# Altium schematic sheet RAK3162_SX1262.SchDoc
size A3; SheetNumber: 2; SheetTotal: 3; PCBA_CODE: 8262XXXX
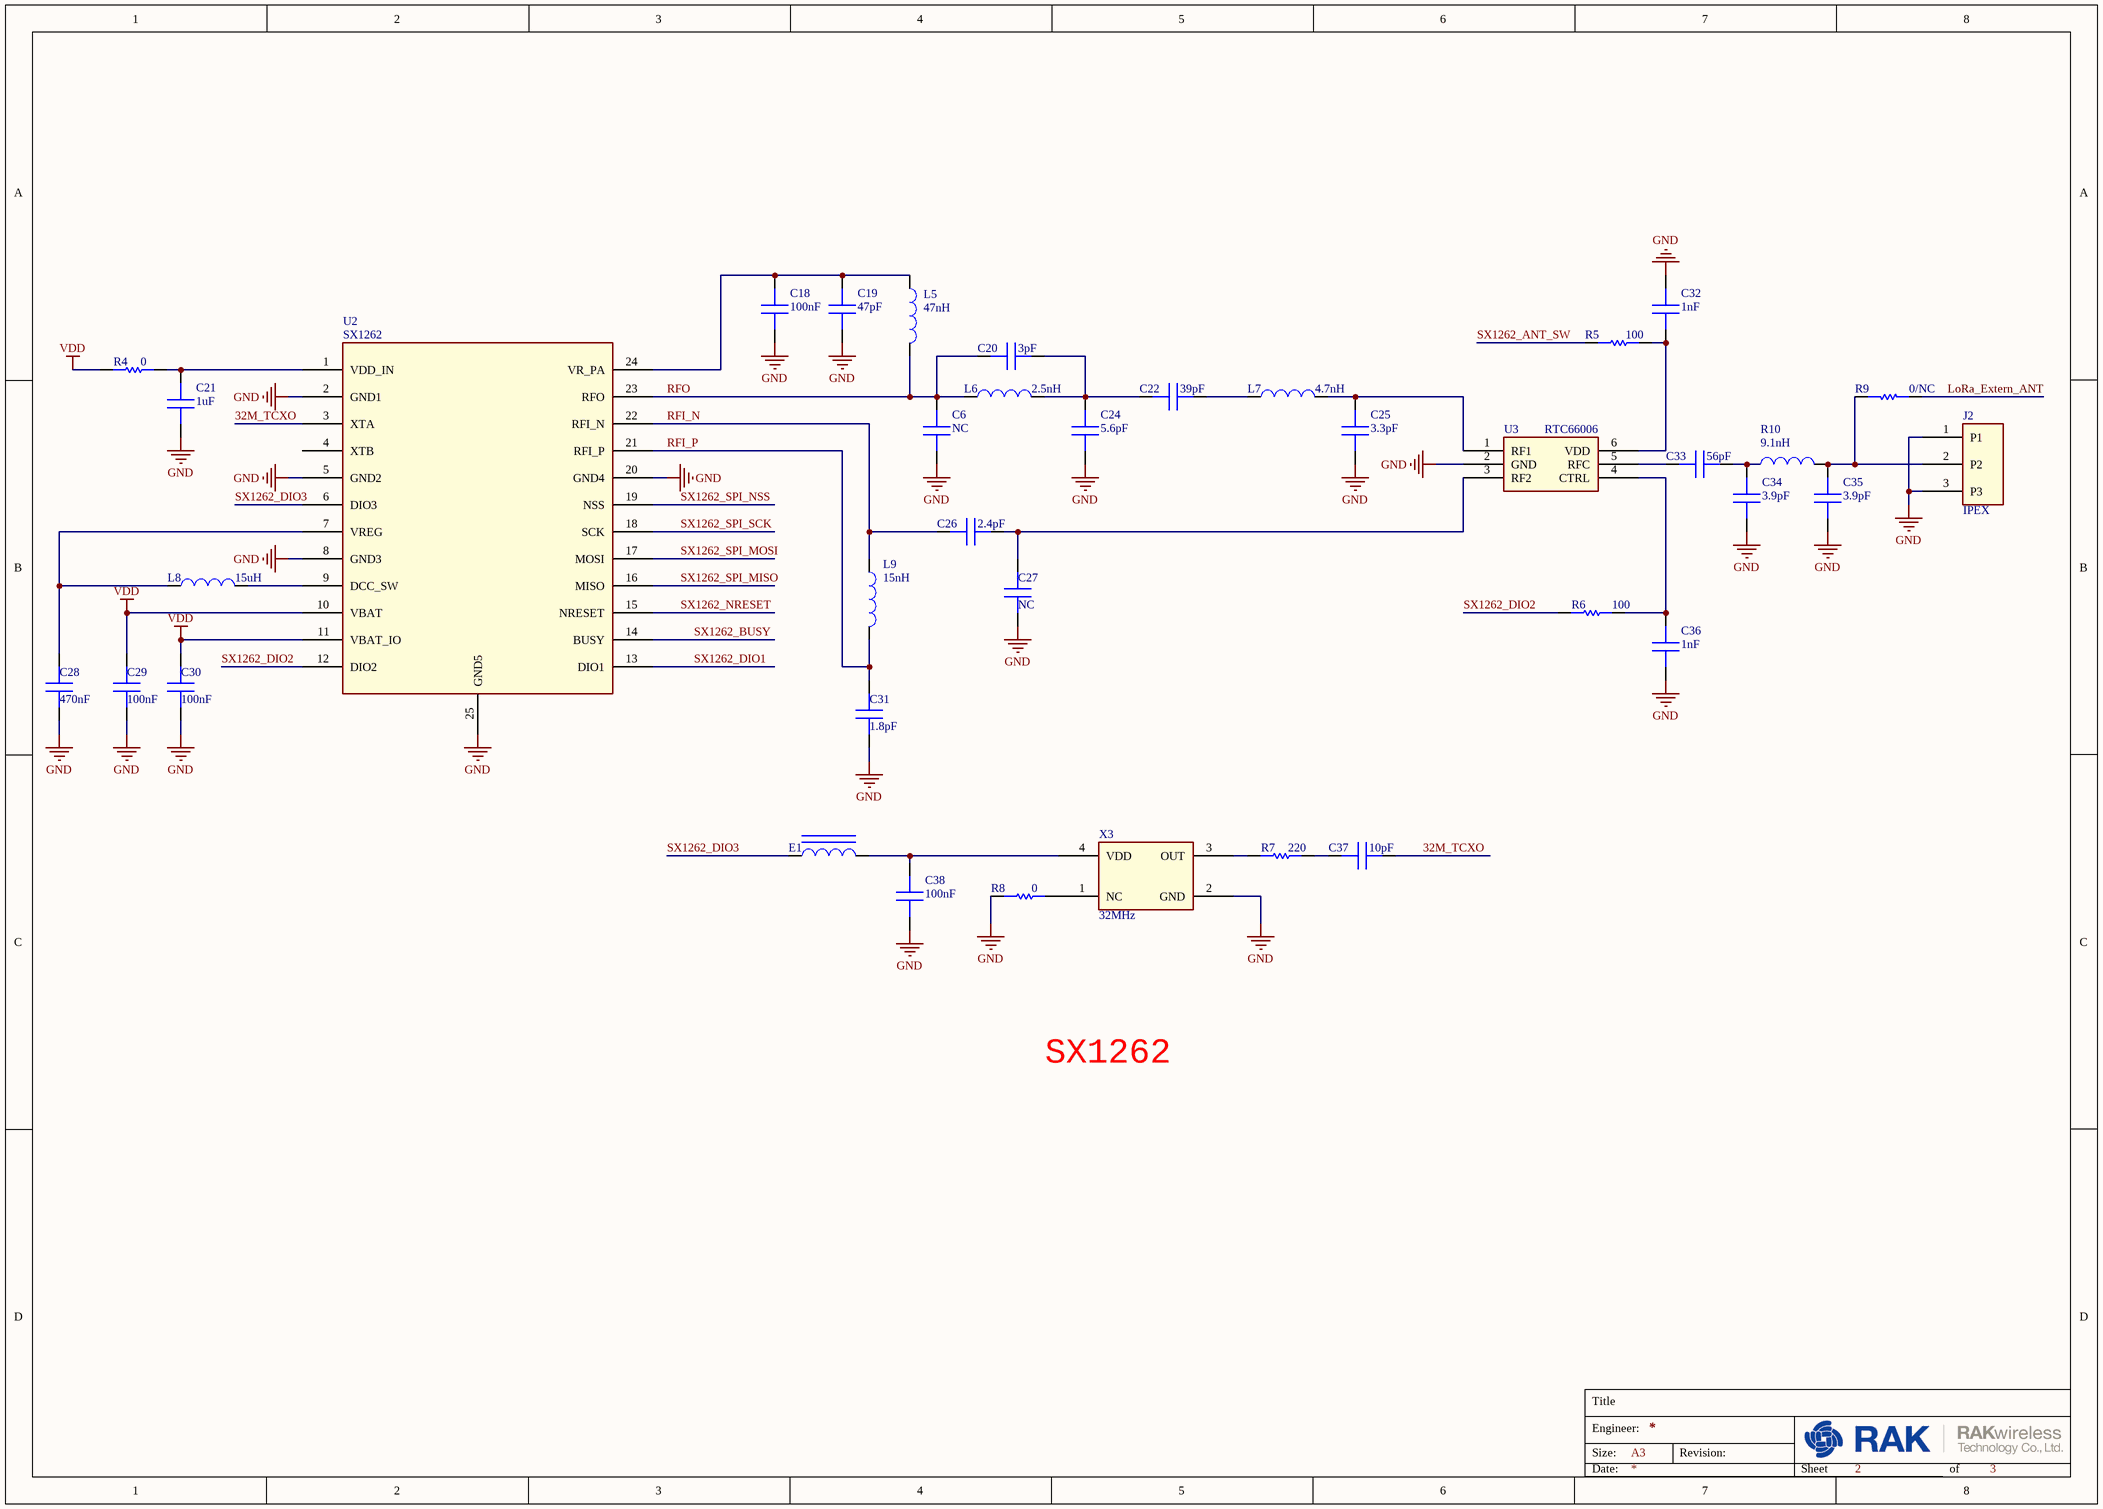
[diagram p0: RAK3162_SX1262.SchDoc]

## Parts
C6  value NC  [sc0201]  (hidden comment: CAPACITOR NP)
C18  value 100nF  [sc0201]  (hidden comment: CAPACITOR NP)
C19  value 47pF  [sc0201]  (hidden comment: CAPACITOR NP)
C20  value 3pF  [sc0201]  (hidden comment: CAPACITOR NP)
C21  value 1uF  [sc0201]  (hidden comment: CAPACITOR NP)
C22  value 39pF  [sc0201]  (hidden comment: CAPACITOR NP)
C24  value 5.6pF  [sc0201]  (hidden comment: CAPACITOR NP)
C25  value 3.3pF  [sc0201]  (hidden comment: CAPACITOR NP)
C26  value 2.4pF  [sc0201]  (hidden comment: CAPACITOR NP)
C27  value NC  [sc0201]  (hidden comment: CAPACITOR NP)
C28  value 470nF  [sc0201]  (hidden comment: CAPACITOR NP)
C29  value 100nF  [sc0201]  (hidden comment: CAPACITOR NP)
C30  value 100nF  [sc0201]  (hidden comment: CAPACITOR NP)
C31  value 1.8pF  [sc0201]  (hidden comment: CAPACITOR NP)
C32  value 1nF  [sc0201]  (hidden comment: CAPACITOR NP)
C33  value 56pF  [sc0201]  (hidden comment: CAPACITOR NP)
C34  value 3.9pF  [sc0201]  (hidden comment: CAPACITOR NP)
C35  value 3.9pF  [sc0201]  (hidden comment: CAPACITOR NP)
C36  value 1nF  [sc0201]  (hidden comment: CAPACITOR NP)
C37  value 10pF  [sc0201]  (hidden comment: CAPACITOR NP)
C38  value 100nF  [sc0201]  (hidden comment: CAPACITOR NP)
E1  BEAD  [SL0201]  (value not drawn)
J2  value IPEX  [SCOXSMA_T]  (hidden comment: UFL)
L5  value 47nH  [SL0402]  (hidden comment: INDUCTOR)
L6  value 2.5nH  [sl0201]  (hidden comment: INDUCTOR)
L7  value 4.7nH  [sl0201]  (hidden comment: INDUCTOR)
L8  value 15uH  [SL0805]  (hidden comment: INDUCTOR)
L9  value 15nH  [sl0201]  (hidden comment: INDUCTOR)
R4  value 0  [sr0201]  (hidden comment: RESISTOR)
R5  value 100  [sr0201]  (hidden comment: RESISTOR)
R6  value 100  [sr0201]  (hidden comment: RESISTOR)
R7  value 220  [sr0201]  (hidden comment: RESISTOR)
R8  value 0  [sr0201]  (hidden comment: RESISTOR)
R9  value 0/NC  [sr0201]  (hidden comment: RESISTOR)
R10  value 9.1nH  [sl0201]  (hidden comment: INDUCTOR)
U2  value SX1262  [VQFN24_4X4MM]  (hidden comment: SX126X)
U3  value RTC66006  [SC-70-6]  (hidden comment: PE4259)
X3  value 32MHz  [S0SC4-2016]  (hidden comment: 32M-TXCO)

## Nets
GND: C6.1(POS) C18.1(POS) C19.1(POS) C21.1(POS) C24.1(POS) C25.1(POS) C27.1(POS) C28.1(POS) C29.1(POS) C30.1(POS) C31.1(POS) C32.2(NEG) C34.1(POS) C35.1(POS) C36.1(POS) C38.1(POS) J2.1(P1) J2.3(P3) R8.2 U2.2(GND1) U2.5(GND2) U2.8(GND3) U2.20(GND4) U2.25(GND5) U3.2(GND) X3.2(GND)
VDD: C29.2(NEG) C30.2(NEG) R4.2 U2.10(VBAT) U2.11(VBAT_IO)
32M_TCXO: C37.2(NEG) U2.3(XTA)
LoRa_Extern_ANT: R9.1
RFI_N: C26.1(POS) L9.1 U2.22(RFI_N)
RFI_P: C31.2(NEG) L9.2 U2.21(RFI_P)
RFO: C6.2(NEG) C20.1(POS) L5.2 L6.1 U2.23(RFO)
SX1262_ANT_SW: R5.2
SX1262_BUSY: U2.14(BUSY)
SX1262_DIO1: U2.13(DIO1)
SX1262_DIO2: R6.2 U2.12(DIO2)
SX1262_DIO3: E1.1 U2.6(DIO3)
SX1262_NRESET: U2.15(NRESET)
SX1262_SPI_MISO: U2.16(MISO)
SX1262_SPI_MOSI: U2.17(MOSI)
SX1262_SPI_NSS: U2.19(NSS)
SX1262_SPI_SCK: U2.18(SCK)
NetC18_2: C18.2(NEG) C19.2(NEG) L5.1 U2.24(VR_PA)
NetC20_2: C20.2(NEG) C22.1(POS) C24.2(NEG) L6.2
NetC21_2: C21.2(NEG) R4.1 U2.1(VDD_IN)
NetC22_2: C22.2(NEG) L7.1
NetC25_2: C25.2(NEG) L7.2 U3.1(RF1)
NetC26_2: C26.2(NEG) C27.2(NEG) U3.3(RF2)
NetC28_2: C28.2(NEG) L8.1 U2.7(VREG)
NetC32_1: C32.1(POS) R5.1 U3.6(VDD)
NetC33_1: C33.1(POS) U3.5(RFC)
NetC33_2: C33.2(NEG) C34.2(NEG) R10.1
NetC35_2: C35.2(NEG) J2.2(P2) R9.2 R10.2
NetC36_2: C36.2(NEG) R6.1 U3.4(CTRL)
NetC37_1: C37.1(POS) R7.1
NetC38_2: C38.2(NEG) E1.2 X3.4(VDD)
NetL8_2: L8.2 U2.9(DCC_SW)
NetR7_2: R7.2 X3.3(OUT)
NetR8_1: R8.1 X3.1(NC)

Not connected (* = marked no-connect by the designer): U2 4(XTB)

## Notes on the sheet
- SX1262
- Title
- Size:
- Engineer:
- A3
- Revision:
- Date:
- Sheet
- of

## Library data of the parts
C6 C24 = 0807C00D: Capacitor-50V-5.6pF-±0.25pF-COG-0201; MANUFACTURER: MURATA; Part Number: GRM0335C1H5R6CA01D; TOLERANCE: ±0.25pF; SYMNAME: CAP; VOLTAGE: 50V; RAK Code: KRAKBJ0807C00D; Classification: SMD Ceramic Capacitor; CODE: 0807C00D
C18 C29 C30 C38 = 0807B00F: Capacitor-6.3V-100nF-±10%-X5R-0201; MANUFACTURER: YAGEO; Part Number: CC0201KRX5R5BB104; TOLERANCE: ±10%; SYMNAME: CAP; VOLTAGE: 6.3V; RAK Code: K3CA10402KA201; Classification: SMD Ceramic Capacitor; CODE: 0807B00F
C19 C27 = 0807C00G: Capacitor-25V-47pF-±5%-NPO-0201; MANUFACTURER: YAGEO; Part Number: CC0201JRNPO8BN470; TOLERANCE: ±5%; SYMNAME: CAP; VOLTAGE: 25V; RAK Code: KRAKBJ0807C00G; Classification: SMD Ceramic Capacitor; CODE: 0807C00G
C20 = 0807C00X: Capacitor-50V-3pF-±0.25pF-NPO-0201; MANUFACTURER: YAGEO; Part Number: CC0201CRNPO9BN3R0; TOLERANCE: ±0.25pF; SYMNAME: CAP; VOLTAGE: 50V; RAK Code: KRAKBJ0807C00X; Classification: SMD Ceramic Capacitor; CODE: 0807C00X
C21 = 0807B00G: Capacitor-6.3V-1uF-±20%-X5R-0201; MANUFACTURER: YAGEO; Part Number: CC0201MRX5R5BB105; TOLERANCE: ±20%; SYMNAME: CAP; VOLTAGE: 6.3V; RAK Code: KRAKBJ0807B00G; Classification: SMD Ceramic Capacitor; CODE: 0807B00G
C22 = 0807C011: Capacitor-25V-39pF-±5%-NPO-0201; MANUFACTURER: YAGEO; Part Number: CC0201JRNPO8BN390; TOLERANCE: ±5%; SYMNAME: CAP; VOLTAGE: 25V; RAK Code: KRAKBJ0807C011; Classification: SMD Ceramic Capacitor; CODE: 0807C011
C25 = 0807B01B: Capacitor-50V-3.3pF-±0.25pF-NPO-0201; MANUFACTURER: YAGEO; Part Number: CC0201CRNPO9BN3R3; TOLERANCE: ±0.25pF; SYMNAME: CAP; VOLTAGE: 50V; RAK Code: KRAKBJ0807B01B; Classification: SMD Ceramic Capacitor; CODE: 0807B01B
C26 = 0807C010: Capacitor-50V-2.4pF-±0.25pF-NPO-0201; MANUFACTURER: YAGEO; Part Number: CC0201CRNPO9BN2R4; TOLERANCE: ±0.25pF; SYMNAME: CAP; VOLTAGE: 50V; RAK Code: KRAKBJ0807C010; Classification: SMD Ceramic Capacitor; CODE: 0807C010
C28 = 0807C02P: Capacitor-6.3V-470nF-±20%-X5R-0201; MANUFACTURER: MURATA; Part Number: GRM033R60J474ME90J; TOLERANCE: ±20%; SYMNAME: CAP; VOLTAGE: 6.3V; Classification: SMD Ceramic Capacitor; CODE: 0807C02P
C31 = 0807B00W: Capacitor-50V-1.8pF-±0.25pF-NPO-0201; MANUFACTURER: YAGEO; Part Number: CC0201CRNPO9BN1R8; TOLERANCE: ±0.25pF; SYMNAME: CAP; VOLTAGE: 50V; RAK Code: K3CA22A06CA201; Classification: SMD Ceramic Capacitor; CODE: 0807B00W
C32 C36 = 0807B00T: Capacitor-25V-1nF-±10%-X7R-0201; MANUFACTURER: YAGEO; Part Number: CC0201KRX7R8BB102; TOLERANCE: ±10%; SYMNAME: CAP; VOLTAGE: 25V; RAK Code: K3CA10204KA201; Classification: SMD Ceramic Capacitor; CODE: 0807B00T
C33 = 0807C02R: Capacitor-25V-56pF-±5%-NPO-0201; MANUFACTURER: 华新科技(WALSIN); Part Number: 0201N560J250CT; TOLERANCE: ±5%; SYMNAME: CAP; VOLTAGE: 25V; Classification: SMD Ceramic Capacitor; CODE: 0807C02R
C34 C35 = 0807C00E: Capacitor-50V-3.9pF-±0.25pF-NPO-0201; MANUFACTURER: YAGEO; Part Number: CC0201CRNPO9BN3R9; TOLERANCE: ±0.25pF; SYMNAME: CAP; VOLTAGE: 50V; RAK Code: KRAKBJ0807C00E; Classification: SMD Ceramic Capacitor; CODE: 0807C00E
C37 = 0807B00J: Capacitor-50V-10pF-±5%-NPO-0201; MANUFACTURER: YAGEO; Part Number: CC0201JRNPO9BN100; TOLERANCE: ±5%; SYMNAME: CAP; VOLTAGE: 50V; RAK Code: K3CA10006JA201; Classification: SMD Ceramic Capacitor; CODE: 0807B00J
E1 = 1007C00B: EMI Ferrite Bead-240Ω±25%@100MHz-0.38Ω-350mA-0201; MANUFACTURER: Murata; Part Number: BLM03AX241SN1D; Current: 350mA; Value: 0.38ohm; Tolerance: ±25%; CODE: 1007C00B; Classification: Bead
J2 = 1404A001: Coaxial Connectors-IPEX MHF1-Receptacle, Male Pin-50Ohm-Surface Mount; MANUFACTURER: BLDZ01; PART_NUMBER: ECT818000071; Part Number: L10-03001-01; RAK Code: K6PRUFLRSMT101; CODE: 1404A001; Classification: Coaxial Connectors
L5 = 1003B01D: Inductor-47nH-±2%-1.15Ω-250mA-0402; MANUFACTURER: MURATA; Part Number: LQG15HN47NG02; RAK Code: KRAKBJ1003B01D; Current: 250mA; Tolerance: ±2%; Classification: SMD Inductor; CODE: 1003B01D
L6 = 1003C012: Inductor-2.5nH-±0.1nH-0.2Ω-500mA-0201; MANUFACTURER: MURATA; Part Number: LQP03TN2N5B02; RAK Code: KRAKBJ1003C012; Tolerance: ±0.1nH; Classification: SMD Inductor; CODE: 1003C012
L7 = 1003C00J: Inductor-4.7nH-±5%-0.4Ω-350mA-0201; MANUFACTURER: MURATA; Part Number: LQP03TN4N7J02D; RAK Code: KRAKBJ1003C00J; Current: 350mA; Tolerance: ±5%; Classification: SMD Inductor; CODE: 1003C00J
L8 = 1003C00V: Inductor-15uH-±20%-0.95Ω±30%-250mA-0805; MANUFACTURER: TDK; Part Number: MLZ2012M150WT000; RAK Code: KRAKBJ1003C00V; Current: 0.25A; Tolerance: ±20%; Classification: SMD Inductor; CODE: 1003C00V
L9 = 1003B00Y: Inductor-15nH-±5%-0.7Ω-250mA-0201; MANUFACTURER: MURATA; Part Number: LQP03TN15NJ02D; RAK Code: KRAKBJ1003B00Y; Tolerance: ±5%; Classification: SMD Inductor; CODE: 1003B00Y
R4 R8 R9 = 0709B00M: Resistor-0Ω-0.5A-50mΩMAX-0201; MANUFACTURER: YAGEO; Part Number: RC0201JR-070RL; RAK Code: K3RS00000JA201; Classification: Thick Film Resistor; CODE: 0709B00M; Tolerance: 50mΩMAX
R5 R6 = 0709B014: Resistor-1/20W-100Ω-±1%-0201; MANUFACTURER: YAGEO; Part Number: RC0201FR-07100RL; RAK Code: KRAKBJ0709B014; Tolerance: ±1%; Classification: Thick Film Resistor; CODE: 0709B014
R7 = 0709C03T: Resistor-1/20W-220Ω-±1%-0201; MANUFACTURER: YAGEO; Part Number: RC0201FR07-220RL; RAK Code: KRAKBJ0709C03T; Tolerance: ±1%; Classification: Thick Film Resistor; CODE: 0709C03T
R10 = 1003C013: Inductor-9.1nH-±3%-0.7Ω-250mA-0201; MANUFACTURER: MURATA; Part Number: LQP03TN9N1H02D; RAK Code: KRAKBJ1003C013; Tolerance: ±3%; Classification: SMD Inductor; CODE: 1003C013
U2 = 4715C009: RF IC-LoRa Transceiver-SX1262IMLTRT-150~960 MHz-22dBm-SF5 to SF12-1.8~3.7V-QFN24-4x4mm; Manufacturer: SEMTECH; RAK Code: KRAKBJ4715C009; Classification: LoRa PHY; Code: 4715C009; Part Number: SX1262IMLTRT
U3 = 4714C004: RF IC-RF Switch-PE4259-10~3000 MHz-SPDT-0.35 dB-30dB-SC-70-6; Manufacturer: PSEMI; RAK Code: K5BS0FE4259SC7; Code: 4714C004; Part Number: PE4259; Classification: RF Switch
X3 = 1202C003: Oscillator-32MHz-TCXO-±2ppm--30℃~85℃-1.8V~3.3V-SMD-2016-4pin; Manufacturer: NDK; Part Number: END4263A; RAK Code: KRAKBJ1202C003; Tolerance: ±2ppm; Code: 1202C003; Classification: Oscillator